# Altium schematic sheet Joystick Board.SchDoc
size A; SheetNumber: 2; SheetTotal: 2
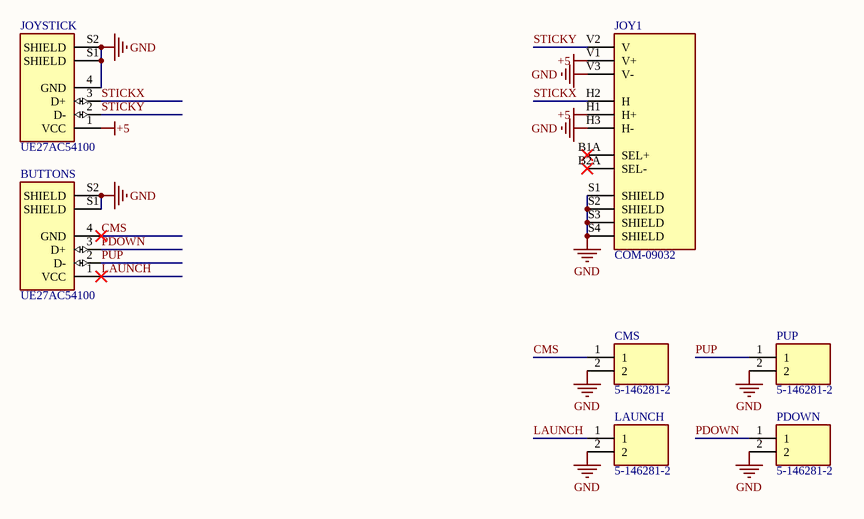
[diagram p0: Joystick Board.SchDoc]

## Parts
BUTTONS  UE27AC54100  [AMPHENOL_UE27AC54100]
CMS  5-146281-2  [TE_5-146281-2]
JOY1  COM-09032  [XDCR_COM-09032]
JOYSTICK  UE27AC54100  [AMPHENOL_UE27AC54100]
LAUNCH  5-146281-2  [TE_5-146281-2]
PDOWN  5-146281-2  [TE_5-146281-2]
PUP  5-146281-2  [TE_5-146281-2]

## Nets
+5: JOY1.H1(H+) JOY1.V1(V+) JOYSTICK.1(VCC)
GND: BUTTONS.S1(SHIELD) BUTTONS.S2(SHIELD) CMS.2 JOY1.H3(H-) JOY1.S1(SHIELD) JOY1.S2(SHIELD) JOY1.S3(SHIELD) JOY1.S4(SHIELD) JOY1.V3(V-) JOYSTICK.4(GND) JOYSTICK.S1(SHIELD) JOYSTICK.S2(SHIELD) LAUNCH.2 PDOWN.2 PUP.2
CMS: BUTTONS.4(GND) CMS.1
LAUNCH: BUTTONS.1(VCC) LAUNCH.1
PDOWN: BUTTONS.3(D+) PDOWN.1
PUP: BUTTONS.2(D-) PUP.1
STICKX: JOY1.H2(H) JOYSTICK.3(D+)
STICKY: JOY1.V2(V) JOYSTICK.2(D-)

Not connected (* = marked no-connect by the designer): JOY1 B1A(SEL+)* B2A(SEL-)*

## Library data of the parts
BUTTONS JOYSTICK = UE27AC54100: USB-A _USB TYPE-A_ USB 2.0 Receptacle Connector 4 Position Through Hole, Right Angle; MF: Amphenol ICC _Commercial Products_; Digi-Key_Purchase_URL: https://www.digikey.com/product-detail/en/amphenol-icc-commercial-products/UE27AC54100/UE27AC54100-ND/1972253?utm_source=snapeda&utm_medium=aggregator&utm_campaign=symbol; Value: *; MP: UE27AC54100; Package: None; SnapEDA_Link: https://www.snapeda.com/parts/UE27AC54100/Amphenol%20Commercial%20Products/view-part/4701388/?ref=snap; Digi-Key_Part_Number: UE27AC54100-ND
CMS LAUNCH PDOWN PUP = 5-146281-2: Header; Breakaway; 0.100 in.; PC Board; Single; 2; 0.025 in.; 0.12 in.; 3 A; MF: TE Connectivity; Number_of_Positions: 2; Centerline_Pitch: 2.54 mm[.1 in]; Product_Type: Connector; EU_RoHS_Compliance: Compliant; SnapEDA_Link: https://www.snapeda.com/parts/5-146281-2/TE%20Connectivity%20AMP%20Connectors/view-part/457165/?ref=snap; Price: None; MP: 5-146281-2; Package: None; Value: *; Availability: Unavailable
JOY1 = COM-09032: Thumb Joystick; Price: None; Package: None; Availability: Unavailable; MP: COM-09032; Value: *